# Altium project MOSS2.PrjPcb
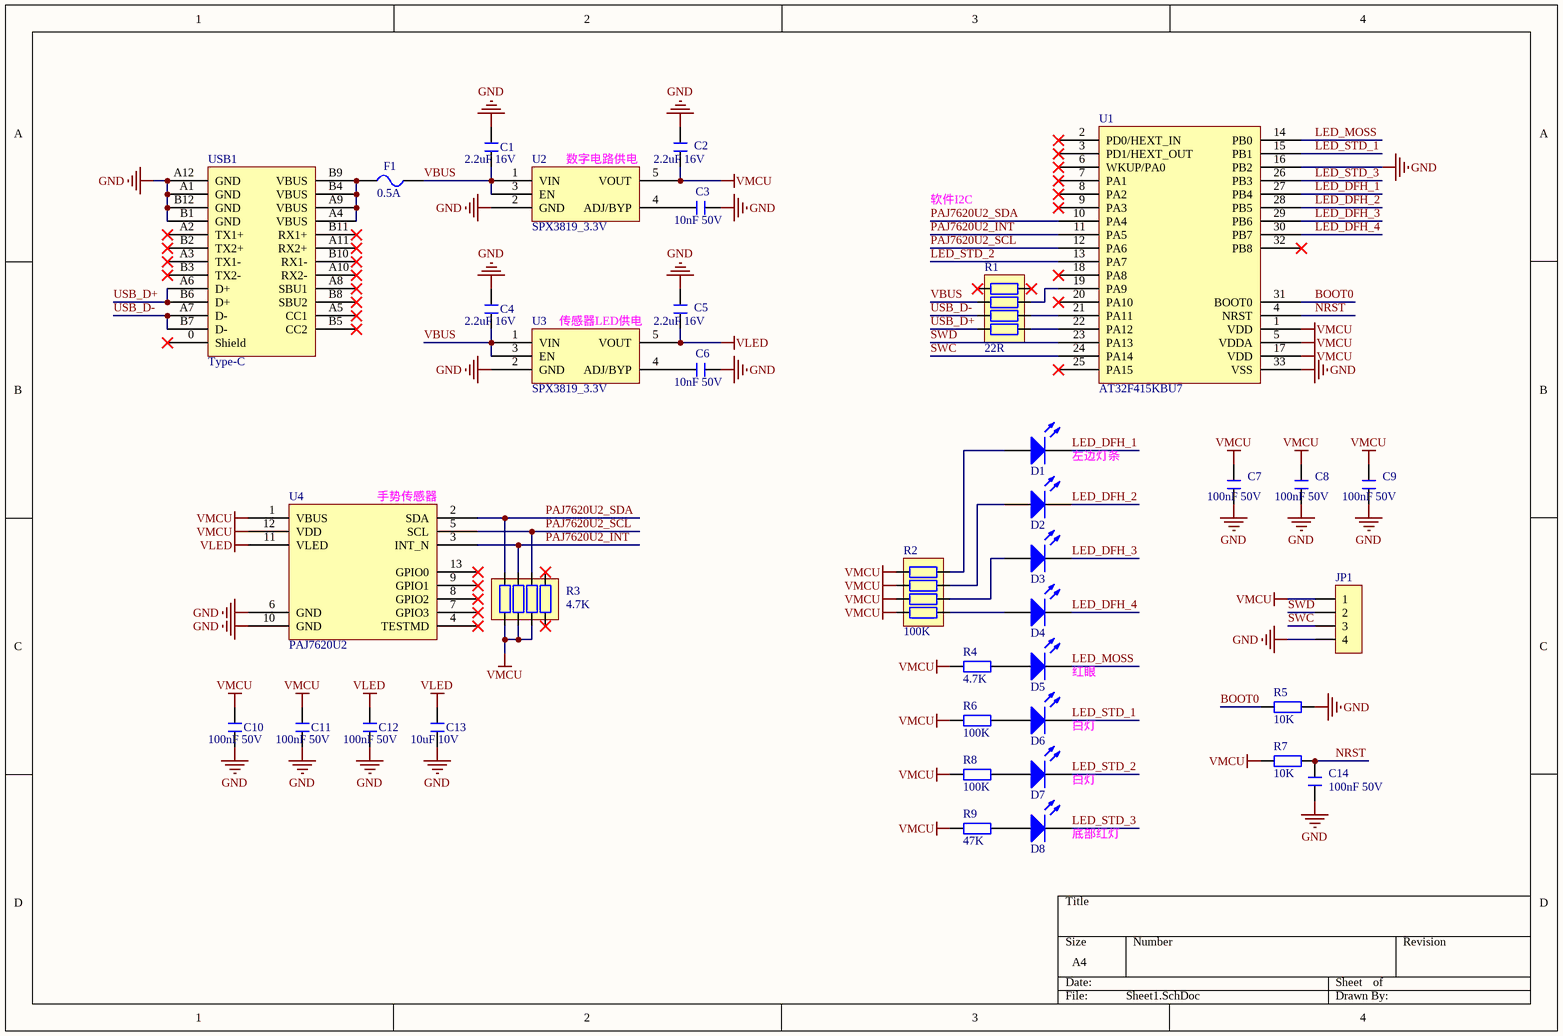
[diagram p0: Sheet1.SchDoc]
1 sheet, 38 parts. Net scope: global (net labels, ports and power ports of the same name join across sheets).
Board file: PCB2.PcbDoc

## Sheet Sheet1.SchDoc
size A4; SheetNumber: 1; SheetTotal: 1

### Parts
C1  2.2uF 16V  [C 0603_L]
C2  2.2uF 16V  [C 0603_L]
C3  10nF 50V  [C 0603_L]
C4  2.2uF 16V  [C 0603_L]
C5  2.2uF 16V  [C 0603_L]
C6  10nF 50V  [C 0603_L]
C7  100nF 50V  [C 0603_L]
C8  100nF 50V  [C 0603_L]
C9  100nF 50V  [C 0603_L]
C10  100nF 50V  [C 0603_L]
C11  100nF 50V  [C 0603_L]
C12  100nF 50V  [C 0603_L]
C13  10uF 10V  [C 0603_L]
C14  100nF 50V  [C 0603_L]
D1  LED  [R 0402_L]  (value not drawn)
D2  LED  [R 0402_L]  (value not drawn)
D3  LED  [R 0402_L]  (value not drawn)
D4  LED  [R 0402_L]  (value not drawn)
D5  LED  [LED_0603]  (value not drawn)
D6  LED  [R 0402_L]  (value not drawn)
D7  LED  [R 0402_L]  (value not drawn)
D8  LED  [LED_0603]  (value not drawn)
F1  0.5A  [FU 0805]
JP1  HDR-1X4  [HDR2.54-LI-4P]  (value not drawn)
R1  22R  [RCA-8P4R-0603]
R2  100K  [RCA-8P4R-0603]
R3  4.7K  [RCA-8P4R-0603]
R4  4.7K  [R 0603_L]
R5  10K  [R 0603_L]
R6  100K  [R 0603_L]
R7  10K  [R 0603_L]
R8  100K  [R 0603_L]
R9  47K  [R 0603_L]
U1  AT32F415KBU7  [QFN-32 4X4]
U2  SPX3819_3.3V  [SOT23-5n]
U3  SPX3819_3.3V  [SOT23-5n]
U4  PAJ7620U2  [QFN-13_L5.2-W3.0_PAJ7620U2]
USB1  Type-C  [USB-TYPE-C_16PIN-MALE-TYPE-C-31-M-12]

### Nets
GND: C1.2 C2.2 C3.1 C4.2 C5.2 C6.1 C7.1 C8.1 C9.1 C10.2 C11.2 C12.2 C13.2 C14.1 JP1.4 R5.1 U1.16(PB2) U1.33(VSS) U2.2(GND) U3.2(GND) U4.6(GND) U4.10(GND) USB1.A1(GND) USB1.A12(GND) USB1.B1(GND) USB1.B12(GND)
VLED: C5.1 C12.1 C13.1 U3.5(VOUT) U4.11(VLED)
VMCU: C2.1 C7.2 C8.2 C9.2 C10.1 C11.1 JP1.1 R2.1 R2.2 R2.3 R2.4 R3.1 R3.2 R3.3 R4.2 R6.2 R7.2 R8.2 R9.2 U1.1(VDD) U1.5(VDDA) U1.17(VDD) U2.5(VOUT) U4.1(VBUS) U4.12(VDD)
BOOT0: R5.2 U1.31(BOOT0)
LED_DFH_1: D1.2(K) U1.27(PB4)
LED_DFH_2: D2.2(K) U1.28(PB5)
LED_DFH_3: D3.2(K) U1.29(PB6)
LED_DFH_4: D4.2(K) U1.30(PB7)
LED_MOSS: D5.2(K) U1.14(PB0)
LED_STD_1: D6.2(K) U1.15(PB1)
LED_STD_2: D7.2(K) U1.13(PA7)
LED_STD_3: D8.2(K) U1.26(PB3)
NRST: C14.2 R7.1 U1.4(NRST)
PAJ7620U2_INT: R3.7 U1.11(PA5) U4.3(INT_N)
PAJ7620U2_SCL: R3.6 U1.12(PA6) U4.5(SCL)
PAJ7620U2_SDA: R3.8 U1.10(PA4) U4.2(SDA)
SWC: JP1.3 U1.24(PA14)
SWD: JP1.2 U1.23(PA13)
USB_D+: R1.4 USB1.A6(D+) USB1.B6(D+)
USB_D-: R1.3 USB1.A7(D-) USB1.B7(D-)
VBUS: C1.1 C4.1 F1.2 R1.2 U2.1(VIN) U2.3(EN) U3.1(VIN) U3.3(EN)
NetC3_2: C3.2 U2.4(ADJ/BYP)
NetC6_2: C6.2 U3.4(ADJ/BYP)
NetD1_1: D1.1(A) R2.8
NetD2_1: D2.1(A) R2.7
NetD3_1: D3.1(A) R2.6
NetD4_1: D4.1(A) R2.5
NetD5_1: D5.1(A) R4.1
NetD6_1: D6.1(A) R6.1
NetD7_1: D7.1(A) R8.1
NetD8_1: D8.1(A) R9.1
NetF1_1: F1.1 USB1.A4(VBUS) USB1.A9(VBUS) USB1.B4(VBUS) USB1.B9(VBUS)
NetR1_5: R1.5 U1.22(PA12)
NetR1_6: R1.6 U1.21(PA11)
NetR1_7: R1.7 U1.19(PA9)

Not connected (* = marked no-connect by the designer): R1 1* 8*; R3 4* 5*; U1 2(PD0/HEXT_IN)* 3(PD1/HEXT_OUT)* 6(WKUP/PA0)* 7(PA1)* 8(PA2)* 9(PA3)* 18(PA8)* 20(PA10)* 25(PA15)* 32(PB8)*; U4 4(TESTMD)* 7(GPIO3)* 8(GPIO2)* 9(GPIO1)* 13(GPIO0)*; USB1 0(Shield)* A2(TX1+)* A3(TX1-)* A5(CC1)* A8(SBU1)* A10(RX2-)* A11(RX2+)* B2(TX2+)* B3(TX2-)* B5(CC2)* B8(SBU2)* B10(RX1-)* B11(RX1+)*

### Notes on the sheet
- (near U2) 数字电路供电
- 软件I2C
- (near U3) 传感器LED供电
- (near U4) 手势传感器
- (near D1) 左边灯条
- (near D5) 红眼
- (near D6) 白灯
- (near D7) 白灯
- (near D8) 底部红灯

### Library data of the parts
C1-C14 = C: 贴片电容; BOM名称: 无极性贴片电容; 优秀评价可免费更新: 联系淘宝ID：黄晶宝石，获取更新版封装库; 卖家免费技术支持，联系售后: 唯一出售店铺网址https://shop463601444.taobao.com; 本封装库来自淘宝卖家 ID：黄晶宝石: 其他店铺购入均为盗版，请立即申请退款
D1-D8 = LED: 发光二极管; 优秀评价可免费更新: 联系淘宝ID：黄晶宝石，获取更新版封装库; 卖家免费技术支持，联系售后: 唯一出售店铺网址https://shop463601444.taobao.com; 封装库来自淘宝卖家 ID：黄晶宝石: 其他店铺购入均为假冒，请立即申请退款，本店奖励2~5元现金; 技术支持，联系售后: https://shop463601444.taobao.com
F1 = FU: 贴片保险丝; 版权归属: 封装库来自淘宝卖家 ID：黄晶宝石; 优秀评价可免费更新: 联系淘宝ID：黄晶宝石，获取更新版封装库; 卖家免费技术支持，联系售后: 唯一出售店铺网址https://shop463601444.taobao.com; 封装库来自淘宝卖家 ID：黄晶宝石: 其他店铺购入均为盗版，请立即申请退款; BOM名称: 贴片保险丝
JP1 = Header 4: 4P接插件; 优秀评价可免费更新封装库: 联系淘宝ID：黄晶宝石，获取更新版封装库; 卖家免费技术支持，联系售后: 唯一出售店铺网址https://shop463601444.taobao.com; 封装库来自淘宝卖家 ID：黄晶宝石: 其他店铺购入均为盗版，请立即申请退款
R1-R3 = R-8P4R: 贴片排阻; BOM名称: 贴片网络排阻; 优秀评价可免费更新: 联系淘宝ID：黄晶宝石，获取更新版封装库; 卖家免费技术支持，联系售后: 唯一出售店铺网址https://shop463601444.taobao.com; 本封装库来自淘宝卖家 ID：黄晶宝石: 其他店铺购入均为盗版，请立即申请退款
R4-R9 = R: 贴片电阻; 优秀评价可免费更新: 联系淘宝ID：黄晶宝石，获取更新版封装库; 卖家免费技术支持，联系售后: 唯一出售店铺网址https://shop463601444.taobao.com; 本封装库来自淘宝卖家 ID：黄晶宝石: 其他店铺购入均为盗版，请立即申请退款; BOM名称: 贴片电阻
U1 = AT32F415K: 基于ARM® 32位的Cortex® / -M4微控制器，带64 K字节至256 K字节闪存、sLib、OTGFS、11个定时器、1个ADC、2个比较器、12个通信接口
U2 U3 = SPX3819: 16V 500mA LDO
U4 = PAJ7620U2: 手势识别传感器